# Altium project HMI_STM32_edited.PrjPcb (part 1 of 2)
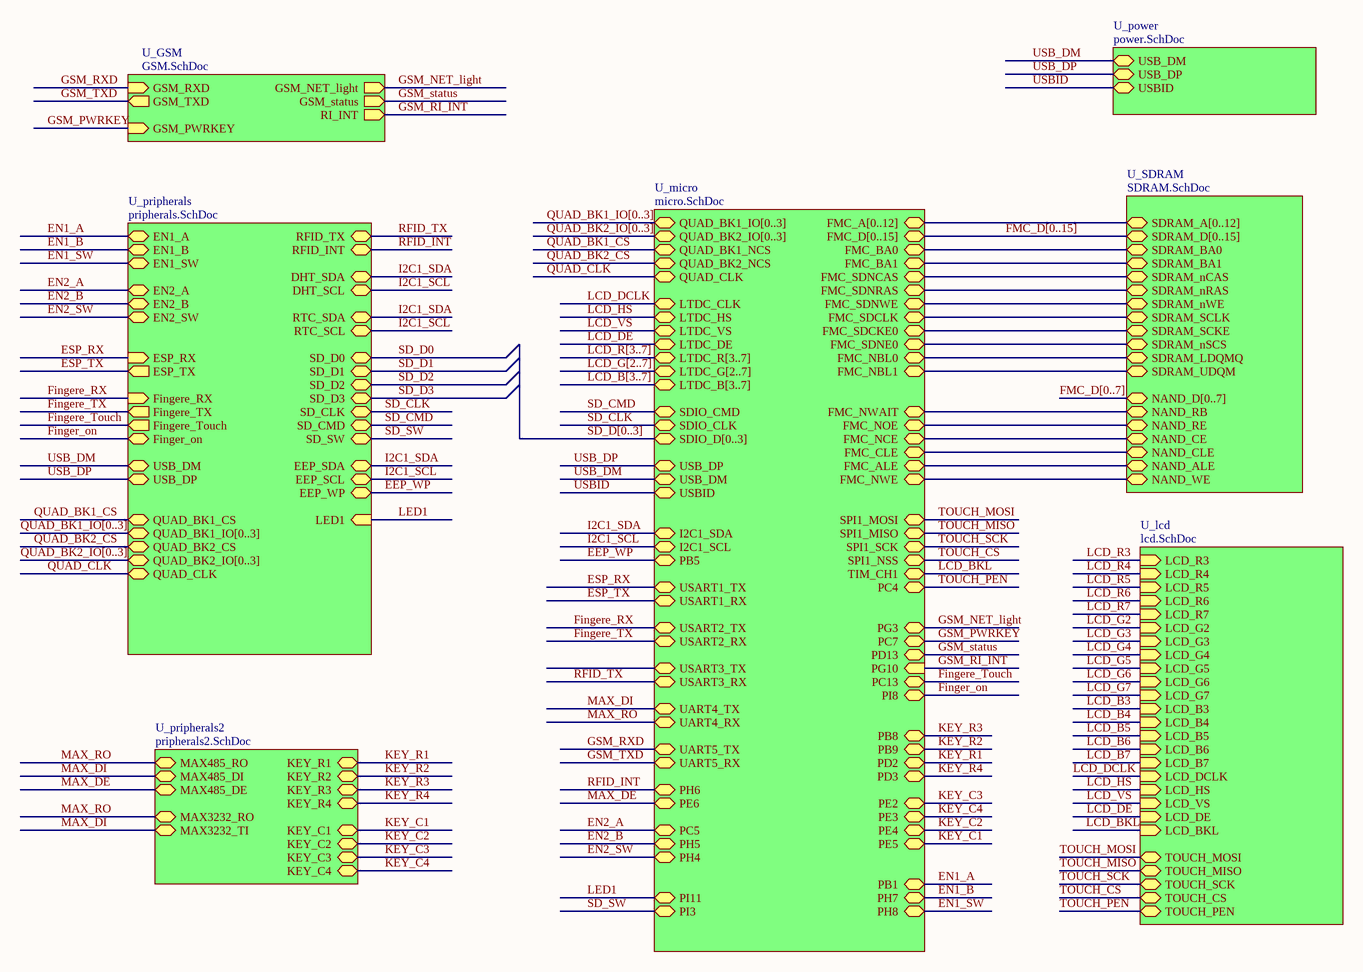
[diagram p0: top.SchDoc]
8 sheets, 237 parts. Net scope: hierarchical (ports join the sheet entries above them; power ports are global).
Board file: HMI_F767_V1.0_edited.PcbDoc
Sheets:
  top.SchDoc
    U_micro = micro.SchDoc
    U_SDRAM = SDRAM.SchDoc
    U_GSM = GSM.SchDoc
    U_lcd = lcd.SchDoc
    U_power = power.SchDoc
    U_pripherals = pripherals.SchDoc
    U_pripherals2 = pripherals2.SchDoc

## Sheet top.SchDoc
size A3

### Sub-sheets
U_GSM = GSM.SchDoc: GSM_PWRKEY (in), GSM_RXD (in), GSM_TXD (out), GSM_NET_light (out), GSM_status (out), RI_INT (out)
U_lcd = lcd.SchDoc: TOUCH_SCK (bidir), TOUCH_CS (bidir), TOUCH_MOSI (bidir), TOUCH_MISO (bidir), TOUCH_PEN (bidir), LCD_B5 (in), LCD_B4 (in), LCD_R7 (in), LCD_B6 (in), LCD_G7 (in), LCD_G6 (in), LCD_G3 (in), LCD_R3 (in), LCD_R5 (in), LCD_R4 (in), LCD_B7 (in), LCD_R6 (in), LCD_G2 (in), LCD_B3 (in), LCD_G5 (in), LCD_G4 (in), LCD_DCLK (in), LCD_DE (in), LCD_HS (in), LCD_VS (in), LCD_BKL (in)
U_micro = micro.SchDoc: FMC_A[0..12] (bidir), FMC_D[0..15] (bidir), QUAD_BK1_IO[0..3] (bidir), QUAD_BK2_IO[0..3] (bidir), LTDC_B[3..7] (bidir), LTDC_R[3..7] (bidir), LTDC_G[2..7] (bidir), SDIO_D[0..3] (bidir), FMC_NCE (bidir), FMC_SDCLK (bidir), FMC_ALE (bidir), FMC_SDNRAS (bidir), FMC_CLE (bidir), FMC_SDNE0 (bidir), FMC_NOE (bidir), FMC_BA1 (bidir), FMC_SDCKE0 (bidir), LTDC_VS (bidir), FMC_NWAIT (bidir), FMC_SDNCAS (bidir), QUAD_BK1_NCS (bidir), LTDC_DE (bidir), LTDC_HS (bidir), LTDC_CLK (bidir), FMC_SDNWE (bidir), QUAD_BK2_NCS (bidir), QUAD_CLK (bidir), FMC_NWE (bidir), SDIO_CLK (bidir), FMC_BA0 (bidir), SDIO_CMD (bidir), FMC_NBL0 (bidir), FMC_NBL1 (bidir), USB_DM (bidir), USB_DP (bidir), SPI1_MOSI (bidir), SPI1_MISO (bidir), TIM_CH1 (bidir), SPI1_SCK (bidir), SPI1_NSS (bidir), PC4 (bidir), I2C1_SDA (bidir), I2C1_SCL (bidir), PB5 (bidir), USART3_TX (bidir), UART5_RX (bidir), UART4_TX (bidir), USART2_TX (bidir), USART1_RX (bidir), USART2_RX (bidir), UART4_RX (bidir), UART5_TX (bidir), USART1_TX (bidir), USART3_RX (bidir), PH6 (bidir), PG3 (bidir), PC7 (bidir), PD13 (bidir), PC13 (bidir), PI8 (bidir), PB8 (bidir), PB9 (bidir), PE3 (bidir), PD2 (bidir), PD3 (bidir), PE2 (bidir), PE4 (bidir), PE5 (bidir), PB1 (bidir), PH8 (bidir), PH7 (bidir), PH4 (bidir), PC5 (bidir), PH5 (bidir), PE6 (bidir), PI3 (bidir), PI11 (bidir), PG10 (in), USBID (bidir)
U_power = power.SchDoc: USB_DM (bidir), USB_DP (bidir), USBID (bidir)
U_pripherals = pripherals.SchDoc: RFID_TX (bidir), RFID_INT (bidir), DHT_SDA (bidir), DHT_SCL (bidir), RTC_SDA (bidir), RTC_SCL (bidir), SD_D0 (bidir), SD_D1 (bidir), SD_D2 (bidir), SD_D3 (bidir), SD_CMD (bidir), SD_CLK (bidir), SD_SW (bidir), EN1_A (bidir), EN1_B (bidir), EN1_SW (bidir), EN2_A (bidir), EN2_B (bidir), EN2_SW (bidir), ESP_TX (out), ESP_RX (in), Fingere_RX (in), Fingere_TX (out), Fingere_Touch (out), EEP_SCL (bidir), EEP_WP (bidir), EEP_SDA (bidir), Finger_on (bidir), LED1 (in), USB_DM (bidir), USB_DP (bidir), QUAD_BK1_CS (bidir), QUAD_BK2_IO[0..3] (bidir), QUAD_BK1_IO[0..3] (bidir), QUAD_BK2_CS (bidir), QUAD_CLK (bidir)
U_pripherals2 = pripherals2.SchDoc: MAX485_RO (bidir), MAX485_DE (bidir), MAX485_DI (bidir), KEY_R1 (bidir), KEY_R2 (bidir), KEY_R3 (bidir), KEY_R4 (bidir), KEY_C1 (bidir), KEY_C2 (bidir), KEY_C3 (bidir), KEY_C4 (bidir), MAX3232_RO (bidir), MAX3232_TI (bidir)
U_SDRAM = SDRAM.SchDoc: SDRAM_D[0..15] (bidir), SDRAM_A[0..12] (bidir), NAND_ALE (bidir), SDRAM_BA0 (bidir), SDRAM_nSCS (bidir), SDRAM_nRAS (bidir), NAND_RE (bidir), SDRAM_nWE (bidir), SDRAM_SCKE (bidir), SDRAM_nCAS (bidir), NAND_CE (bidir), SDRAM_LDQMQ (bidir), NAND_D[0..7] (bidir), NAND_CLE (bidir), NAND_WE (bidir), SDRAM_UDQM (bidir), NAND_RB (bidir), SDRAM_SCLK (bidir), SDRAM_BA1 (bidir)

### Nets
EEP_WP: sheet U_micro/PB5, sheet U_pripherals/EEP_WP
EN1_A: sheet U_micro/PB1, sheet U_pripherals/EN1_A
EN1_B: sheet U_micro/PH7, sheet U_pripherals/EN1_B
EN1_SW: sheet U_micro/PH8, sheet U_pripherals/EN1_SW
EN2_A: sheet U_micro/PC5, sheet U_pripherals/EN2_A
EN2_B: sheet U_micro/PH5, sheet U_pripherals/EN2_B
EN2_SW: sheet U_micro/PH4, sheet U_pripherals/EN2_SW
ESP_RX: sheet U_micro/USART1_TX, sheet U_pripherals/ESP_RX
ESP_TX: sheet U_micro/USART1_RX, sheet U_pripherals/ESP_TX
Finger_on: sheet U_micro/PI8, sheet U_pripherals/Finger_on
Fingere_RX: sheet U_micro/USART2_TX, sheet U_pripherals/Fingere_RX  [project net Finger_RX]
Fingere_Touch: sheet U_micro/PC13, sheet U_pripherals/Fingere_Touch  [project net Finger_Touch]
Fingere_TX: sheet U_micro/USART2_RX, sheet U_pripherals/Fingere_TX  [project net Finger_TX]
FMC_ALE: sheet U_micro/FMC_ALE, sheet U_SDRAM/NAND_ALE
FMC_BA0: sheet U_micro/FMC_BA0, sheet U_SDRAM/SDRAM_BA0
FMC_BA1: sheet U_micro/FMC_BA1, sheet U_SDRAM/SDRAM_BA1
FMC_CLE: sheet U_micro/FMC_CLE, sheet U_SDRAM/NAND_CLE
FMC_NCE: sheet U_micro/FMC_NCE, sheet U_SDRAM/NAND_CE
FMC_NOE: sheet U_micro/FMC_NOE, sheet U_SDRAM/NAND_RE
FMC_NWAIT: sheet U_micro/FMC_NWAIT, sheet U_SDRAM/NAND_RB
FMC_NWE: sheet U_micro/FMC_NWE, sheet U_SDRAM/NAND_WE
FMC_SDCKE0: sheet U_micro/FMC_SDCKE0, sheet U_SDRAM/SDRAM_SCKE
FMC_SDCLK: sheet U_micro/FMC_SDCLK, sheet U_SDRAM/SDRAM_SCLK
FMC_SDNCAS: sheet U_micro/FMC_SDNCAS, sheet U_SDRAM/SDRAM_nCAS
FMC_SDNE0: sheet U_micro/FMC_SDNE0, sheet U_SDRAM/SDRAM_nSCS
FMC_SDNRAS: sheet U_micro/FMC_SDNRAS, sheet U_SDRAM/SDRAM_nRAS
FMC_SDNWE: sheet U_micro/FMC_SDNWE, sheet U_SDRAM/SDRAM_nWE
GSM_NET_light: sheet U_micro/PG3, sheet U_GSM/GSM_NET_light
GSM_PWRKEY: sheet U_micro/PC7, sheet U_GSM/GSM_PWRKEY
GSM_RI_INT: sheet U_micro/PG10, sheet U_GSM/RI_INT
GSM_RXD: sheet U_micro/UART5_TX, sheet U_GSM/GSM_RXD
GSM_status: sheet U_micro/PD13, sheet U_GSM/GSM_status
GSM_TXD: sheet U_micro/UART5_RX, sheet U_GSM/GSM_TXD
I2C1_SCL: sheet U_micro/I2C1_SCL, sheet U_pripherals/DHT_SCL, sheet U_pripherals/RTC_SCL, sheet U_pripherals/EEP_SCL  [project net EEP_SCL]
I2C1_SDA: sheet U_micro/I2C1_SDA, sheet U_pripherals/DHT_SDA, sheet U_pripherals/RTC_SDA, sheet U_pripherals/EEP_SDA  [project net EEP_SDA]
KEY_C1: sheet U_micro/PE5, sheet U_pripherals2/KEY_C1
KEY_C2: sheet U_micro/PE4, sheet U_pripherals2/KEY_C2
KEY_C3: sheet U_micro/PE2, sheet U_pripherals2/KEY_C3
KEY_C4: sheet U_micro/PE3, sheet U_pripherals2/KEY_C4
KEY_R1: sheet U_micro/PD2, sheet U_pripherals2/KEY_R1
KEY_R2: sheet U_micro/PB9, sheet U_pripherals2/KEY_R2
KEY_R3: sheet U_micro/PB8, sheet U_pripherals2/KEY_R3
KEY_R4: sheet U_micro/PD3, sheet U_pripherals2/KEY_R4
LCD_BKL: sheet U_micro/TIM_CH1, sheet U_lcd/LCD_BKL
LCD_DCLK: sheet U_micro/LTDC_CLK, sheet U_lcd/LCD_DCLK
LCD_DE: sheet U_micro/LTDC_DE, sheet U_lcd/LCD_DE
LCD_HS: sheet U_micro/LTDC_HS, sheet U_lcd/LCD_HS
LCD_VS: sheet U_micro/LTDC_VS, sheet U_lcd/LCD_VS
LED1: sheet U_micro/PI11, sheet U_pripherals/LED1
MAX_DE: sheet U_micro/PE6, sheet U_pripherals2/MAX485_DE
MAX_DI: sheet U_micro/UART4_TX, sheet U_pripherals2/MAX485_DI, sheet U_pripherals2/MAX3232_TI
MAX_RO: sheet U_micro/UART4_RX, sheet U_pripherals2/MAX485_RO, sheet U_pripherals2/MAX3232_RO
QUAD_BK1_CS: sheet U_micro/QUAD_BK1_NCS, sheet U_pripherals/QUAD_BK1_CS
QUAD_BK2_CS: sheet U_micro/QUAD_BK2_NCS, sheet U_pripherals/QUAD_BK2_CS
QUAD_CLK: sheet U_micro/QUAD_CLK, sheet U_pripherals/QUAD_CLK
RFID_INT: sheet U_micro/PH6, sheet U_pripherals/RFID_INT
RFID_TX: sheet U_micro/USART3_RX, sheet U_pripherals/RFID_TX
SD_CLK: sheet U_micro/SDIO_CLK, sheet U_pripherals/SD_CLK
SD_CMD: sheet U_micro/SDIO_CMD, sheet U_pripherals/SD_CMD
SD_SW: sheet U_micro/PI3, sheet U_pripherals/SD_SW
TOUCH_CS: sheet U_micro/SPI1_NSS, sheet U_lcd/TOUCH_CS
TOUCH_MISO: sheet U_micro/SPI1_MISO, sheet U_lcd/TOUCH_MISO
TOUCH_MOSI: sheet U_micro/SPI1_MOSI, sheet U_lcd/TOUCH_MOSI
TOUCH_PEN: sheet U_micro/PC4, sheet U_lcd/TOUCH_PEN
TOUCH_SCK: sheet U_micro/SPI1_SCK, sheet U_lcd/TOUCH_SCK
USB_DM: sheet U_micro/USB_DM, sheet U_power/USB_DM, sheet U_pripherals/USB_DM
USB_DP: sheet U_micro/USB_DP, sheet U_power/USB_DP, sheet U_pripherals/USB_DP
USBID: sheet U_micro/USBID, sheet U_power/USBID
NetU4_15: sheet U_micro/FMC_NBL0, sheet U_SDRAM/SDRAM_LDQMQ
NetU4_39: sheet U_micro/FMC_NBL1, sheet U_SDRAM/SDRAM_UDQM

### Buses and harness runs
bus FMC_D[0..7] = sheet U_SDRAM/NAND_D[0..7]
bus FMC_D[0..15] = sheet U_micro/FMC_D[0..15] = sheet U_SDRAM/SDRAM_D[0..15]
bus LCD_B[3..7] = sheet U_micro/LTDC_B[3..7]
bus LCD_G[2..7] = sheet U_micro/LTDC_G[2..7]
bus LCD_R[3..7] = sheet U_micro/LTDC_R[3..7]
bus QUAD_BK1_IO[0..3] = sheet U_micro/QUAD_BK1_IO[0..3]
bus QUAD_BK1_IO[0..3] = sheet U_pripherals/QUAD_BK1_IO[0..3]
bus QUAD_BK2_IO[0..3] = sheet U_micro/QUAD_BK2_IO[0..3]
bus QUAD_BK2_IO[0..3] = sheet U_pripherals/QUAD_BK2_IO[0..3]
bus SD_D[0..3] = sheet U_micro/SDIO_D[0..3]
bus sheet U_micro/FMC_A[0..12] = sheet U_SDRAM/SDRAM_A[0..12]

## Sheet micro.SchDoc: Micro controller
size A3; Author: Babaabasi; Engineer: Babaabasi; DocumentNumber: 1; Revision: 0.1
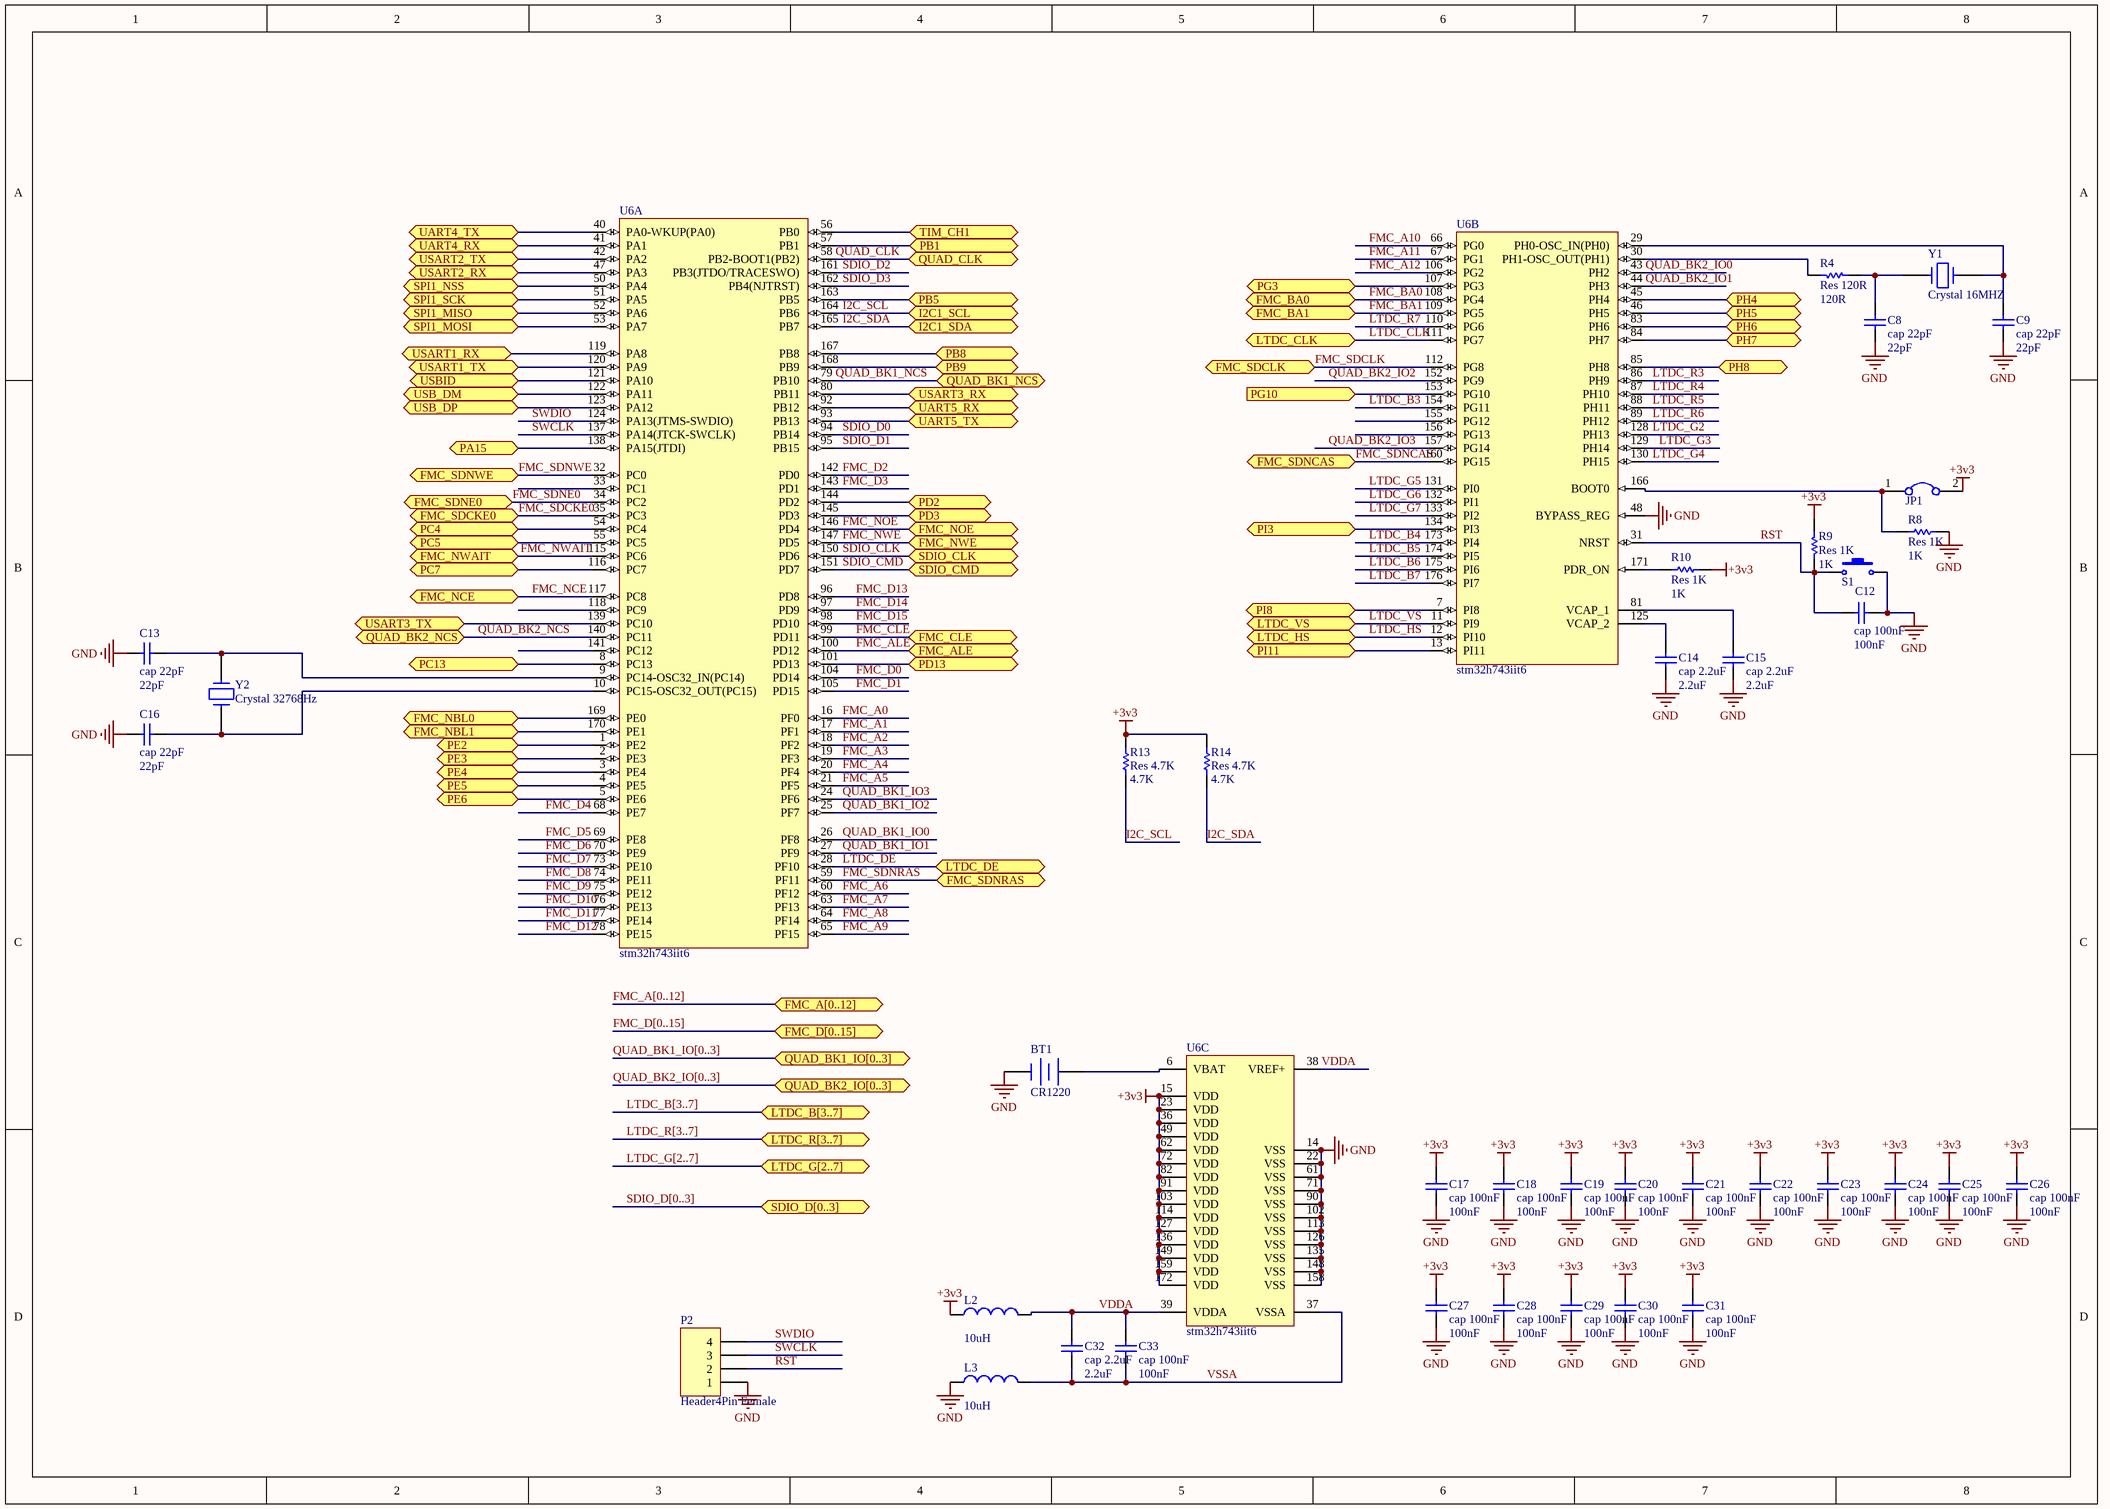
[diagram p1: micro.SchDoc]

### Parts
BT1  CR1220  [BTH1220]
C8  cap 22pF  value 22pF  [Cap 805]
C9  cap 22pF  value 22pF  [Cap 805]
C12  cap 100nF  value 100nF  [Cap 805]
C13  cap 22pF  value 22pF  [Cap 805]
C14  cap 2.2uF  value 2.2uF  [Cap 805]
C15  cap 2.2uF  value 2.2uF  [Cap 805]
C16  cap 22pF  value 22pF  [Cap 805]
C17  cap 100nF  value 100nF  [Cap 805]
C18  cap 100nF  value 100nF  [Cap 805]
C19  cap 100nF  value 100nF  [Cap 805]
C20  cap 100nF  value 100nF  [Cap 805]
C21  cap 100nF  value 100nF  [Cap 805]
C22  cap 100nF  value 100nF  [Cap 805]
C23  cap 100nF  value 100nF  [Cap 805]
C24  cap 100nF  value 100nF  [Cap 805]
C25  cap 100nF  value 100nF  [Cap 805]
C26  cap 100nF  value 100nF  [Cap 805]
C27  cap 100nF  value 100nF  [Cap 805]
C28  cap 100nF  value 100nF  [Cap 805]
C29  cap 100nF  value 100nF  [Cap 805]
C30  cap 100nF  value 100nF  [Cap 805]
C31  cap 100nF  value 100nF  [Cap 805]
C32  cap 2.2uF  value 2.2uF  [Cap 805]
C33  cap 100nF  value 100nF  [Cap 805]
JP1  Jumper  [Jumper Small - 2.54 - GRAY]  (value not drawn)  (no BOM)
L2  value 10uH  [IND1206]  (hidden comment: inductor 10uH)
L3  value 10uH  [IND1206]  (hidden comment: inductor 10uH)
P2  Header4Pin Female  [HDR1X4]
R4  Res 120R  value 120R  [RES 0805 (2012X06L)]
R8  Res 1K  value 1K  [RES 0805 (2012X06L)]
R9  Res 1K  value 1K  [RES 0805 (2012X06L)]
R10  Res 1K  value 1K  [RES 0805 (2012X06L)]
R13  Res 4.7K  value 4.7K  [RES 0805 (2012X06L)]
R14  Res 4.7K  value 4.7K  [RES 0805 (2012X06L)]
S1  Switch PB  [Switch - Push to On]  (value not drawn)
U6  stm32h743iit6  [STM-LQFP176_M]  (parts A,B,C of 3)
Y1  Crystal 16MHZ  [CRYSTAL Small]
Y2  Crystal 32768Hz  [XTAL RTC]

### Ports
FMC_A[0..12] (bidir), FMC_ALE (bidir), FMC_BA0 (bidir), FMC_BA1 (bidir), FMC_CLE (bidir), FMC_D[0..15] (bidir), FMC_NBL0 (bidir), FMC_NBL1 (bidir), FMC_NCE (bidir), FMC_NOE (bidir), FMC_NWAIT (bidir), FMC_NWE (bidir), FMC_SDCKE0 (bidir), FMC_SDCLK (bidir), FMC_SDNCAS (bidir), FMC_SDNE0 (bidir), FMC_SDNRAS (bidir), FMC_SDNWE (bidir), I2C1_SCL (bidir), I2C1_SDA (bidir), LTDC_B[3..7] (bidir), LTDC_CLK (bidir), LTDC_DE (bidir), LTDC_G[2..7] (bidir), LTDC_HS (bidir), LTDC_R[3..7] (bidir), LTDC_VS (bidir), PA15 (bidir), PB1 (bidir), PB5 (bidir), PB8 (bidir), PB9 (bidir), PC4 (bidir), PC5 (bidir), PC7 (bidir), PC13 (bidir), PD2 (bidir), PD3 (bidir), PD13 (bidir), PE2 (bidir), PE3 (bidir), PE4 (bidir), PE5 (bidir), PE6 (bidir), PG3 (bidir), PG10 (in), PH4 (bidir), PH5 (bidir), PH6 (bidir), PH7 (bidir), PH8 (bidir), PI3 (bidir), PI8 (bidir), PI11 (bidir), QUAD_BK1_IO[0..3] (bidir), QUAD_BK1_NCS (bidir), QUAD_BK2_IO[0..3] (bidir), QUAD_BK2_NCS (bidir), QUAD_CLK (bidir), SDIO_CLK (bidir), SDIO_CMD (bidir), SDIO_D[0..3] (bidir), SPI1_MISO (bidir), SPI1_MOSI (bidir), SPI1_NSS (bidir), SPI1_SCK (bidir), TIM_CH1 (bidir), UART4_RX (bidir), UART4_TX (bidir), UART5_RX (bidir), UART5_TX (bidir), USART1_RX (bidir), USART1_TX (bidir), USART2_RX (bidir), USART2_TX (bidir), USART3_RX (bidir), USART3_TX (bidir), USB_DM (bidir), USB_DP (bidir), USBID (bidir)

### Nets
+3v3: C17.2 C18.2 C19.2 C20.2 C21.2 C22.2 C23.2 C24.2 C25.2 C26.2 C27.2 C28.2 C29.2 C30.2 C31.2 JP1.2 L2.1 R9.1 R10.2 R13.1 R14.1 U6.15(VDD) U6.23(VDD) U6.36(VDD) U6.49(VDD) U6.62(VDD) U6.72(VDD) U6.82(VDD) U6.91(VDD) U6.103(VDD) U6.114(VDD) U6.127(VDD) U6.136(VDD) U6.149(VDD) U6.159(VDD) U6.172(VDD)
GND: BT1.2(-) C8.1 C9.2 C12.2 C13.1 C14.1 C15.1 C16.1 C17.1 C18.1 C19.1 C20.1 C21.1 C22.1 C23.1 C24.1 C25.1 C26.1 C27.1 C28.1 C29.1 C30.1 C31.1 L3.1 P2.1 R8.2 S1.1 U6.14(VSS) U6.22(VSS) U6.48(BYPASS_REG) U6.61(VSS) U6.71(VSS) U6.90(VSS) U6.102(VSS) U6.113(VSS) U6.126(VSS) U6.135(VSS) U6.148(VSS) U6.158(VSS)
EEP_WP: U6.163(PB5) ; port PB5
EN1_A: U6.57(PB1) ; port PB1
EN1_B: U6.84(PH7) ; port PH7
EN1_SW: U6.85(PH8) ; port PH8
EN2_A: U6.55(PC5) ; port PC5
EN2_B: U6.46(PH5) ; port PH5
EN2_SW: U6.45(PH4) ; port PH4
ESP_RX: U6.120(PA9) ; port USART1_TX
ESP_TX: U6.119(PA8) ; port USART1_RX
Finger_on: U6.7(PI8) ; port PI8
Finger_RX: U6.42(PA2) ; port USART2_TX
Finger_Touch: U6.8(PC13) ; port PC13
Finger_TX: U6.47(PA3) ; port USART2_RX
FMC_A0: U6.16(PF0)
FMC_A1: U6.17(PF1)
FMC_A2: U6.18(PF2)
FMC_A3: U6.19(PF3)
FMC_A4: U6.20(PF4)
FMC_A5: U6.21(PF5)
FMC_A6: U6.60(PF12)
FMC_A7: U6.63(PF13)
FMC_A8: U6.64(PF14)
FMC_A9: U6.65(PF15)
FMC_A10: U6.66(PG0)
FMC_A11: U6.67(PG1)
FMC_A12: U6.106(PG2)
FMC_ALE: U6.100(PD12) ; port FMC_ALE
FMC_BA0: U6.108(PG4) ; port FMC_BA0
FMC_BA1: U6.109(PG5) ; port FMC_BA1
FMC_CLE: U6.99(PD11) ; port FMC_CLE
FMC_D0: U6.104(PD14)
FMC_D1: U6.105(PD15)
FMC_D2: U6.142(PD0)
FMC_D3: U6.143(PD1)
FMC_D4: U6.68(PE7)
FMC_D5: U6.69(PE8)
FMC_D6: U6.70(PE9)
FMC_D7: U6.73(PE10)
FMC_D8: U6.74(PE11)
FMC_D9: U6.75(PE12)
FMC_D10: U6.76(PE13)
FMC_D11: U6.77(PE14)
FMC_D12: U6.78(PE15)
FMC_D13: U6.96(PD8)
FMC_D14: U6.97(PD9)
FMC_D15: U6.98(PD10)
FMC_NCE: U6.117(PC8) ; port FMC_NCE
FMC_NOE: U6.146(PD4) ; port FMC_NOE
FMC_NWAIT: U6.115(PC6) ; port FMC_NWAIT
FMC_NWE: U6.147(PD5) ; port FMC_NWE
FMC_SDCKE0: U6.35(PC3) ; port FMC_SDCKE0
FMC_SDCLK: U6.112(PG8) ; port FMC_SDCLK
FMC_SDNCAS: U6.160(PG15) ; port FMC_SDNCAS
FMC_SDNE0: U6.34(PC2) ; port FMC_SDNE0
FMC_SDNRAS: U6.59(PF11) ; port FMC_SDNRAS
FMC_SDNWE: U6.32(PC0) ; port FMC_SDNWE
GSM_NET_light: U6.107(PG3) ; port PG3
GSM_PWRKEY: U6.116(PC7) ; port PC7
GSM_RI_INT: U6.153(PG10) ; port PG10
GSM_RXD: U6.93(PB13) ; port UART5_TX
GSM_status: U6.101(PD13) ; port PD13
GSM_TXD: U6.92(PB12) ; port UART5_RX
I2C_SCL: R13.2 U6.164(PB6) ; port I2C1_SCL  [project net EEP_SCL]
I2C_SDA: R14.2 U6.165(PB7) ; port I2C1_SDA  [project net EEP_SDA]
KEY_C1: U6.4(PE5) ; port PE5
KEY_C2: U6.3(PE4) ; port PE4
KEY_C3: U6.1(PE2) ; port PE2
KEY_C4: U6.2(PE3) ; port PE3
KEY_R1: U6.144(PD2) ; port PD2
KEY_R2: U6.168(PB9) ; port PB9
KEY_R3: U6.167(PB8) ; port PB8
KEY_R4: U6.145(PD3) ; port PD3
LCD_BKL: U6.56(PB0) ; port TIM_CH1
LED1: U6.13(PI11) ; port PI11
LTDC_B3: U6.154(PG11)  [project net LCD_B3]
LTDC_B4: U6.173(PI4)  [project net LCD_B4]
LTDC_B5: U6.174(PI5)  [project net LCD_B5]
LTDC_B6: U6.175(PI6)  [project net LCD_B6]
LTDC_B7: U6.176(PI7)  [project net LCD_B7]
LTDC_CLK: U6.111(PG7) ; port LTDC_CLK  [project net LCD_DCLK]
LTDC_DE: U6.28(PF10) ; port LTDC_DE  [project net LCD_DE]
LTDC_G2: U6.128(PH13)  [project net LCD_G2]
LTDC_G3: U6.129(PH14)  [project net LCD_G3]
LTDC_G4: U6.130(PH15)  [project net LCD_G4]
LTDC_G5: U6.131(PI0)  [project net LCD_G5]
LTDC_G6: U6.132(PI1)  [project net LCD_G6]
LTDC_G7: U6.133(PI2)  [project net LCD_G7]
LTDC_HS: U6.12(PI10) ; port LTDC_HS  [project net LCD_HS]
LTDC_R3: U6.86(PH9)  [project net LCD_R3]
LTDC_R4: U6.87(PH10)  [project net LCD_R4]
LTDC_R5: U6.88(PH11)  [project net LCD_R5]
LTDC_R6: U6.89(PH12)  [project net LCD_R6]
LTDC_R7: U6.110(PG6)  [project net LCD_R7]
LTDC_VS: U6.11(PI9) ; port LTDC_VS  [project net LCD_VS]
MAX_DE: U6.5(PE6) ; port PE6
MAX_DI: U6.40(PA0-WKUP(PA0)) ; port UART4_TX
MAX_RO: U6.41(PA1) ; port UART4_RX
QUAD_BK1_IO0: U6.26(PF8)
QUAD_BK1_IO1: U6.27(PF9)
QUAD_BK1_IO2: U6.25(PF7)
QUAD_BK1_IO3: U6.24(PF6)
QUAD_BK1_NCS: U6.79(PB10) ; port QUAD_BK1_NCS  [project net QUAD_BK1_CS]
QUAD_BK2_IO0: U6.43(PH2)
QUAD_BK2_IO1: U6.44(PH3)
QUAD_BK2_IO2: U6.152(PG9)
QUAD_BK2_IO3: U6.157(PG14)
QUAD_BK2_NCS: U6.140(PC11) ; port QUAD_BK2_NCS  [project net QUAD_BK2_CS]
QUAD_CLK: U6.58(PB2-BOOT1(PB2)) ; port QUAD_CLK
RFID_INT: U6.83(PH6) ; port PH6
RFID_TX: U6.80(PB11) ; port USART3_RX
RST: C12.1 P2.2 R9.2 S1.2 U6.31(NRST)
SD_SW: U6.134(PI3) ; port PI3
SDIO_CLK: U6.150(PD6) ; port SDIO_CLK  [project net SD_CLK]
SDIO_CMD: U6.151(PD7) ; port SDIO_CMD  [project net SD_CMD]
SDIO_D0: U6.94(PB14)  [project net SD_D0]
SDIO_D1: U6.95(PB15)  [project net SD_D1]
SDIO_D2: U6.161(PB3(JTDO/TRACESWO))  [project net SD_D2]
SDIO_D3: U6.162(PB4(NJTRST))  [project net SD_D3]
SWCLK: P2.3 U6.137(PA14(JTCK-SWCLK))
SWDIO: P2.4 U6.124(PA13(JTMS-SWDIO))
TOUCH_CS: U6.50(PA4) ; port SPI1_NSS
TOUCH_MISO: U6.52(PA6) ; port SPI1_MISO
TOUCH_MOSI: U6.53(PA7) ; port SPI1_MOSI
TOUCH_PEN: U6.54(PC4) ; port PC4
TOUCH_SCK: U6.51(PA5) ; port SPI1_SCK
USB_DM: U6.122(PA11) ; port USB_DM
USB_DP: U6.123(PA12) ; port USB_DP
USBID: U6.121(PA10) ; port USBID
VDDA: C32.2 C33.2 L2.2 U6.38(VREF+) U6.39(VDDA)
VSSA: C32.1 C33.1 L3.2 U6.37(VSSA)
NetBT1_1: BT1.1(+) U6.6(VBAT)
NetC8_2: C8.2 R4.2 Y1.2
NetC9_1: C9.1 U6.29(PH0-OSC_IN(PH0)) Y1.1
NetC13_2: C13.2 U6.9(PC14-OSC32_IN(PC14)) Y2.1
NetC14_2: C14.2 U6.125(VCAP_2)
NetC15_2: C15.2 U6.81(VCAP_1)
NetC16_2: C16.2 U6.10(PC15-OSC32_OUT(PC15)) Y2.2
NetJP1_1: JP1.1 R8.1 U6.166(BOOT0)
NetR4_1: R4.1 U6.30(PH1-OSC_OUT(PH1))
NetR10_1: R10.1 U6.171(PDR_ON)
NetU4_15: U6.169(PE0) ; port FMC_NBL0
NetU4_39: U6.170(PE1) ; port FMC_NBL1
NetU6_138: U6.138(PA15(JTDI)) ; port PA15
NetU6_139: U6.139(PC10) ; port USART3_TX

Not connected (* = marked no-connect by the designer): U6 33(PC1) 118(PC9) 141(PC12) 155(PG12) 156(PG13)

### Buses and harness runs
bus FMC_A[0..12] = port FMC_A[0..12]
bus FMC_D[0..15] = port FMC_D[0..15]
bus LTDC_B[3..7] = port LTDC_B[3..7]
bus LTDC_G[2..7] = port LTDC_G[2..7]
bus LTDC_R[3..7] = port LTDC_R[3..7]
bus QUAD_BK1_IO[0..3] = port QUAD_BK1_IO[0..3]
bus QUAD_BK2_IO[0..3] = port QUAD_BK2_IO[0..3]
bus SDIO_D[0..3] = port SDIO_D[0..3]

### Notes on the sheet
- Title
- Size:
- Date:
- A3
- Number:
- Time:
- Revision:
- Sheet
- of
- File:

### Library data of the parts
BT1 = Battery: CoinCell Battery; Published: 24-Mar-1999; LatestRevisionDate: 17-Jul-2002; LatestRevisionNote: Re-released for DXP Platform.; PackageReference: BAT-2; Publisher: Altium Limited; PackageDescription: Battery; 2 Leads
C8 C9 C12-C33 = Cap: Capacitor; Published: 8-Jun-2000; LatestRevisionDate: 17-Jul-2002; LatestRevisionNote: Re-released for DXP Platform.; PackageReference: RAD-0.3; Publisher: Altium Limited; PackageDescription: Radial Cap, Thru-Hole; 2 Leads; 0.3 in Pin Spacing
JP1 = Jumper: Boot select; Company: E.P.I.L; Defualt State: Close; Design Date: 2011/11/02
L2 L3 = Inductor: Code_IEC: 1005; Published: 8-Jun-2000; LatestRevisionDate: 29-May-2009; LatestRevisionNote: IPC-7351 Footprint Added.; PackageReference: 0402-A; Publisher: Altium Limited; PackageDescription: Chip Inductor; Code_JEITA: 0402
P2 = Header 4: Header, 4-Pin; LatestRevisionDate: 17-Jul-2002; LatestRevisionNote: Re-released for DXP Platform.; Publisher: Altium Limited
R4 R8-R10 R13 R14 = Res1: Resistor; Published: 8-Jun-2000; LatestRevisionDate: 17-Jul-2002; LatestRevisionNote: Re-released for DXP Platform.; PackageReference: AXIAL-0.3; Publisher: Altium Limited; PackageDescription: Axial Device, Thru-Hole; 2 Leads; 0.3 in Pin Spacing
S1 = Switch PB: Push Button Switch
U6 = STM32F429IGT6: ARM Cortex-M4 32-bit MCU+FPU, 225 DMIPS, 1024 kB Flash, 256 kB Internal RAM, 140 I/Os, 176-pin LQFP, -40 to 85 degC, Tray; Manufacturer: STMicroelectronics; D/A Converter: 2x12-bit; FLASH Size (Prog) (kB): 1024; I/Os (High Current): 140; Internal RAM Size (kB): 256; Operating Frequency(F) (Processor speed) (MHz): 180; Supply Voltage(Vcc) max (V): 3.6; Supply Voltage(Vcc) min (V): 1.8; DatasheetVersion: Rev. 2; PackageVersion: Rev. 4, 06/2013; PackageReference: LQFP176; PackageDescription: 176-Pin Low Profile Quad Flat Package, 24 x 24 mm Body, 0.5 mm Pitch; Supplier 1: Digi-Key; Supplier Part Number 1: STM32F429IGT6-ND; Supplier 2: Newark; Supplier Part Number 2: 06X3669; Supplier 3: Mouser; Supplier Part Number 3: 511-STM32F429IGT6; Core: ARM Cortex-M4; Packing: Tray; Mounting Technology: Surface Mount; PartNumber: STM32F429IGT6; ComponentLink1Description: Manufacturer URL; ComponentLink1URL: http://www.st.com/web/en/home.html; ComponentLink2Description: Datasheet; ComponentLink2URL: http://www.st.com/st-web-ui/static/active/en/resource/technical/document/data_brief/DM00053488.pdf; ComponentLink3Description: Package Specification; ComponentLink3URL: http://www.st.com/st-web-ui/static/active/en/resource/technical/document/datasheet/DM00035129.pdf
Y1 Y2 = CRYSTAL

## Sheet SDRAM.SchDoc
size A4
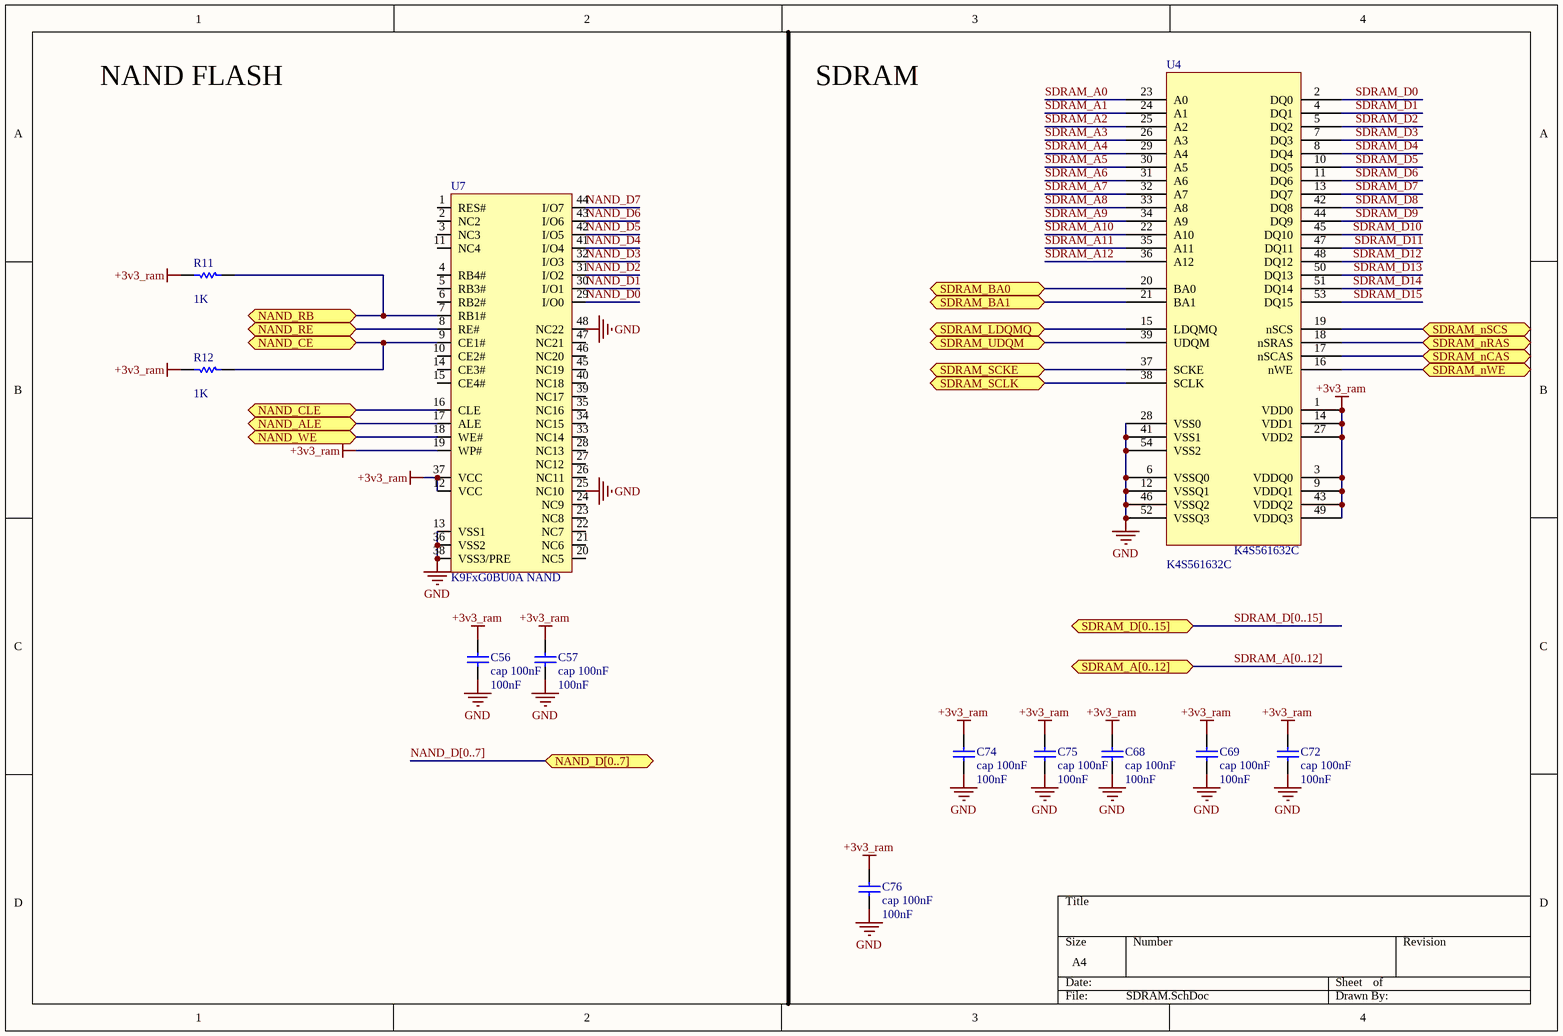
[diagram p2: SDRAM.SchDoc]

### Parts
C56  cap 100nF  value 100nF  [Cap 805]
C57  cap 100nF  value 100nF  [Cap 805]
C68  cap 100nF  value 100nF  [Cap 805]
C69  cap 100nF  value 100nF  [Cap 805]
C72  cap 100nF  value 100nF  [Cap 805]
C74  cap 100nF  value 100nF  [Cap 805]
C75  cap 100nF  value 100nF  [Cap 805]
C76  cap 100nF  value 100nF  [Cap 805]
R11  value 1K  [RES 0805 (2012X06L)]  (hidden comment: Res 1K)
R12  value 1K  [RES 0805 (2012X06L)]  (hidden comment: Res 1K)
U4  K4S561632C  [RAM]
U7  K9FxG0BU0A NAND  [TSOP-48]

### Ports
NAND_ALE (bidir), NAND_CE (bidir), NAND_CLE (bidir), NAND_D[0..7] (bidir), NAND_RB (bidir), NAND_RE (bidir), NAND_WE (bidir), SDRAM_A[0..12] (bidir), SDRAM_BA0 (bidir), SDRAM_BA1 (bidir), SDRAM_D[0..15] (bidir), SDRAM_LDQMQ (bidir), SDRAM_nCAS (bidir), SDRAM_nRAS (bidir), SDRAM_nSCS (bidir), SDRAM_nWE (bidir), SDRAM_SCKE (bidir), SDRAM_SCLK (bidir), SDRAM_UDQM (bidir)

### Nets
+3v3_ram: C56.2 C57.2 C68.2 C69.2 C72.2 C74.2 C75.2 C76.2 R11.2 R12.1 U4.1(VDD0) U4.3(VDDQ0) U4.9(VDDQ1) U4.14(VDD1) U4.27(VDD2) U4.43(VDDQ2) U4.49(VDDQ3) U7.12(VCC) U7.19(WP#) U7.37(VCC)
GND: C56.1 C57.1 C68.1 C69.1 C72.1 C74.1 C75.1 C76.1 U4.6(VSSQ0) U4.12(VSSQ1) U4.28(VSS0) U4.41(VSS1) U4.46(VSSQ2) U4.52(VSSQ3) U4.54(VSS2) U7.13(VSS1) U7.25(NC10) U7.36(VSS2) U7.38(VSS3/PRE) U7.48(NC22)
FMC_ALE: U7.17(ALE) ; port NAND_ALE
FMC_BA0: U4.20(BA0) ; port SDRAM_BA0
FMC_BA1: U4.21(BA1) ; port SDRAM_BA1
FMC_CLE: U7.16(CLE) ; port NAND_CLE
FMC_NCE: R12.2 U7.9(CE1#) ; port NAND_CE
FMC_NOE: U7.8(RE#) ; port NAND_RE
FMC_NWAIT: R11.1 U7.7(RB1#) ; port NAND_RB
FMC_NWE: U7.18(WE#) ; port NAND_WE
FMC_SDCKE0: U4.37(SCKE) ; port SDRAM_SCKE
FMC_SDCLK: U4.38(SCLK) ; port SDRAM_SCLK
FMC_SDNCAS: U4.17(nSCAS) ; port SDRAM_nCAS
FMC_SDNE0: U4.19(nSCS) ; port SDRAM_nSCS
FMC_SDNRAS: U4.18(nSRAS) ; port SDRAM_nRAS
FMC_SDNWE: U4.16(nWE) ; port SDRAM_nWE
NAND_D0: U4.2(DQ0) U7.29(I/O0)  [also labelled SDRAM_D0]  [project net FMC_D0]
NAND_D1: U4.4(DQ1) U7.30(I/O1)  [also labelled SDRAM_D1]  [project net FMC_D1]
NAND_D2: U4.5(DQ2) U7.31(I/O2)  [also labelled SDRAM_D2]  [project net FMC_D2]
NAND_D3: U4.7(DQ3) U7.32(I/O3)  [also labelled SDRAM_D3]  [project net FMC_D3]
NAND_D4: U4.8(DQ4) U7.41(I/O4)  [also labelled SDRAM_D4]  [project net FMC_D4]
NAND_D5: U4.10(DQ5) U7.42(I/O5)  [also labelled SDRAM_D5]  [project net FMC_D5]
NAND_D6: U4.11(DQ6) U7.43(I/O6)  [also labelled SDRAM_D6]  [project net FMC_D6]
NAND_D7: U4.13(DQ7) U7.44(I/O7)  [also labelled SDRAM_D7]  [project net FMC_D7]
SDRAM_A0: U4.23(A0)  [project net FMC_A0]
SDRAM_A1: U4.24(A1)  [project net FMC_A1]
SDRAM_A2: U4.25(A2)  [project net FMC_A2]
SDRAM_A3: U4.26(A3)  [project net FMC_A3]
SDRAM_A4: U4.29(A4)  [project net FMC_A4]
SDRAM_A5: U4.30(A5)  [project net FMC_A5]
SDRAM_A6: U4.31(A6)  [project net FMC_A6]
SDRAM_A7: U4.32(A7)  [project net FMC_A7]
SDRAM_A8: U4.33(A8)  [project net FMC_A8]
SDRAM_A9: U4.34(A9)  [project net FMC_A9]
SDRAM_A10: U4.22(A10)  [project net FMC_A10]
SDRAM_A11: U4.35(A11)  [project net FMC_A11]
SDRAM_A12: U4.36(A12)  [project net FMC_A12]
SDRAM_D8: U4.42(DQ8)  [project net FMC_D8]
SDRAM_D9: U4.44(DQ9)  [project net FMC_D9]
SDRAM_D10: U4.45(DQ10)  [project net FMC_D10]
SDRAM_D11: U4.47(DQ11)  [project net FMC_D11]
SDRAM_D12: U4.48(DQ12)  [project net FMC_D12]
SDRAM_D13: U4.50(DQ13)  [project net FMC_D13]
SDRAM_D14: U4.51(DQ14)  [project net FMC_D14]
SDRAM_D15: U4.53(DQ15)  [project net FMC_D15]
NetU4_15: U4.15(LDQMQ) ; port SDRAM_LDQMQ
NetU4_39: U4.39(UDQM) ; port SDRAM_UDQM

Not connected (* = marked no-connect by the designer): U7 1(RES#) 2(NC2) 3(NC3) 4(RB4#) 5(RB3#) 6(RB2#) 10(CE2#) 11(NC4) 14(CE3#) 15(CE4#) 20(NC5) 21(NC6) 22(NC7) 23(NC8) 24(NC9) 26(NC11) 27(NC12) 28(NC13) 33(NC14) 34(NC15) 35(NC16) 39(NC17) 40(NC18) 45(NC19) 46(NC20) 47(NC21)

### Buses and harness runs
bus NAND_D[0..7] = port NAND_D[0..7]
bus SDRAM_A[0..12] = port SDRAM_A[0..12]
bus SDRAM_D[0..15] = port SDRAM_D[0..15]

### Notes on the sheet
- NAND FLASH
- SDRAM

### Library data of the parts
C56 C57 C68 C69 C72 C74-C76 = Cap: Capacitor; Published: 8-Jun-2000; LatestRevisionDate: 17-Jul-2002; LatestRevisionNote: Re-released for DXP Platform.; PackageReference: RAD-0.3; Publisher: Altium Limited; PackageDescription: Radial Cap, Thru-Hole; 2 Leads; 0.3 in Pin Spacing
R11 R12 = Res1: Resistor; Published: 8-Jun-2000; LatestRevisionDate: 17-Jul-2002; LatestRevisionNote: Re-released for DXP Platform.; PackageReference: AXIAL-0.3; Publisher: Altium Limited; PackageDescription: Axial Device, Thru-Hole; 2 Leads; 0.3 in Pin Spacing
U4 = K4S561632C: MT48LC16M16A2P or K4S561632C SDram
U7 = K9FxG0BU0A NAND: Nand Flash

## Sheet GSM.SchDoc
size A4
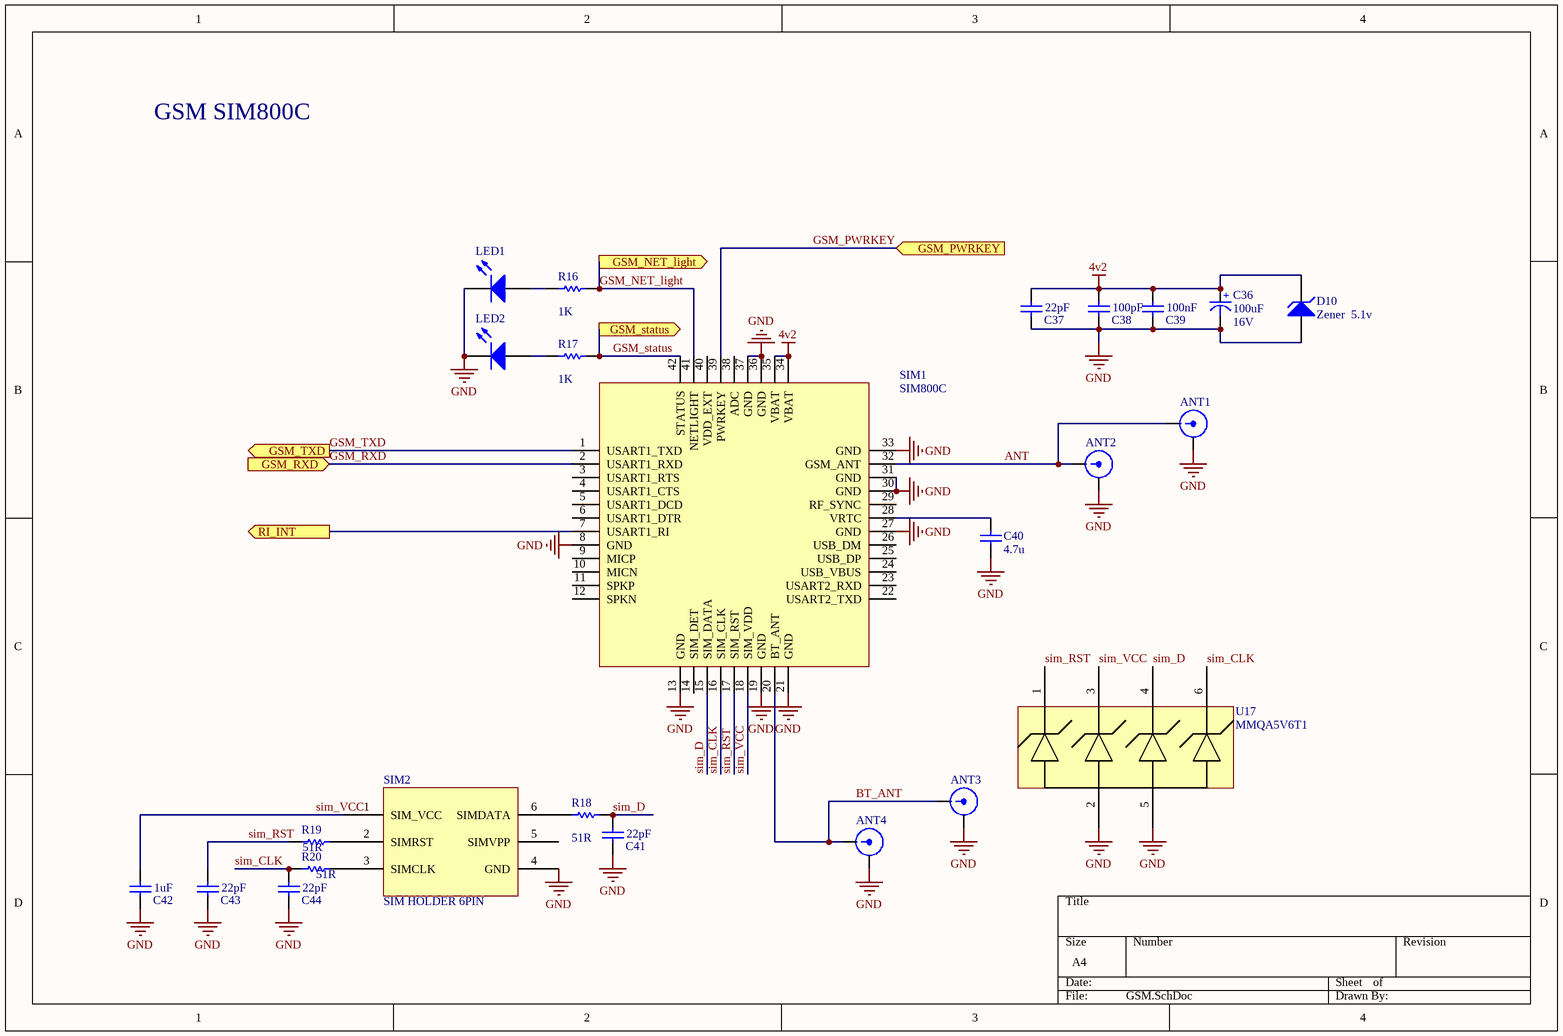
[diagram p3: GSM.SchDoc]

### Parts
ANT1  Antenna UFL  [UFL ant]  (value not drawn)
ANT2  Antenna SMA  [SMA]  (value not drawn)
ANT3  Antenna UFL  [UFL ant]  (value not drawn)
ANT4  Antenna SMA  [SMA]  (value not drawn)
C36  value 100uF  Voltage: 16V  [Cap 1206 (3216X18L) Size A]  (hidden comment: cap 100uF)
C37  value 22pF  [Cap 805]  (hidden comment: cap 22pF)
C38  value 100pF  [Cap 805]  (hidden comment: cap 100pF)
C39  value 100nF  [Cap 805]  (hidden comment: cap 100nF)
C40  value 4.7u  [Cap 805]  (hidden comment: cap 4.7u)
C41  value 22pF  [Cap 805]  (hidden comment: cap 22pF)
C42  value 1uF  [Cap 805]  (hidden comment: cap 1uF)
C43  value 22pF  [Cap 805]  (hidden comment: cap 22pF)
C44  value 22pF  [Cap 805]  (hidden comment: cap 22pF)
D10  Zener  5.1v  [Diode 1n4148 SMD]
LED1  LED Green  [0805-LED]  (value not drawn)
LED2  LED Red  [0805-LED]  (value not drawn)
R16  value 1K  [RES 0805 (2012X06L)]  (hidden comment: Res 1K)
R17  value 1K  [RES 0805 (2012X06L)]  (hidden comment: Res 1K)
R18  value 51R  [RES 0805 (2012X06L)]  (hidden comment: Res 51R)
R19  value 51R  [RES 0805 (2012X06L)]  (hidden comment: Res 51R)
R20  value 51R  [RES 0805 (2012X06L)]  (hidden comment: Res 51R)
SIM1  SIM800C  [SIM800C]
SIM2  SIM HOLDER 6PIN  [simcard_holder]
U17  MMQA5V6T1  [SOT23-6]

### Ports
GSM_NET_light (out), GSM_PWRKEY (in), GSM_RXD (in), GSM_status (out), GSM_TXD (out), RI_INT (out)

### Nets
4v2: C36.1(+) C37.2 C38.2 C39.2 D10.2(K) SIM1.34(VBAT) SIM1.35(VBAT)
GND: ANT1.2 ANT2.2 ANT3.2 ANT4.2 C36.2(-) C37.1 C38.1 C39.1 C40.1 C41.1 C42.1 C43.1 C44.1 D10.1(A) LED1.K LED2.K SIM1.8(GND) SIM1.13(GND) SIM1.19(GND) SIM1.21(GND) SIM1.27(GND) SIM1.30(GND) SIM1.31(GND) SIM1.33(GND) SIM1.36(GND) SIM1.37(GND) SIM2.4(GND) U17.2(Cathode) U17.5(Cathode)
ANT: ANT1.1 ANT2.1 SIM1.32(GSM_ANT)
BT_ANT: ANT3.1 ANT4.1 SIM1.20(BT_ANT)
GSM_NET_light: R16.1 SIM1.41(NETLIGHT) ; port GSM_NET_light
GSM_PWRKEY: SIM1.39(PWRKEY) ; port GSM_PWRKEY
GSM_RI_INT: SIM1.7(USART1_RI) ; port RI_INT
GSM_RXD: SIM1.2(USART1_RXD) ; port GSM_RXD
GSM_status: R17.1 SIM1.42(STATUS) ; port GSM_status
GSM_TXD: SIM1.1(USART1_TXD) ; port GSM_TXD
sim_CLK: C44.2 R20.1 SIM1.16(SIM_CLK) U17.6(Cathode)
sim_D: C41.2 R18.2 SIM1.15(SIM_DATA) U17.4(Cathode)
sim_RST: C43.2 R19.1 SIM1.17(SIM_RST) U17.1(Cathode)
sim_VCC: C42.2 SIM1.18(SIM_VDD) SIM2.1(SIM_VCC) U17.3(Cathode)
NetC40_2: C40.2 SIM1.28(VRTC)
NetLED1_A: LED1.A R16.2
NetLED2_A: LED2.A R17.2
NetR18_1: R18.1 SIM2.6(SIMDATA)
NetR19_2: R19.2 SIM2.2(SIMRST)
NetR20_2: R20.2 SIM2.3(SIMCLK)

Not connected (* = marked no-connect by the designer): SIM1 3(USART1_RTS) 4(USART1_CTS) 5(USART1_DCD) 6(USART1_DTR) 9(MICP) 10(MICN) 11(SPKP) 12(SPKN) 14(SIM_DET) 22(USART2_TXD) 23(USART2_RXD) 24(USB_VBUS) 25(USB_DP) 26(USB_DM) 29(RF_SYNC) 38(ADC) 40(VDD_EXT); SIM2 5(SIMVPP)

### Notes on the sheet
- GSM SIM800C

### Library data of the parts
ANT1 ANT3 = ANT SMA: Antenna; pin to pad: 1>S 2>G; Designer: Ali Hafizi
ANT2 ANT4 = ANT SMA: Antenna; Designer: Ali Hafizi
C36 = Cap-Polar: Tantal Capacitor Size A; Designer: Saeid Jorablo; Organazation: ControTec; Adding Date: 1387/12/20
C37-C44 = Cap ceramic: Capacitor
D10 = D Zener: Zener Diode; Published: 8-Jun-2000; LatestRevisionDate: 17-Jul-2002; LatestRevisionNote: Re-released for DXP Platform.; PackageReference: DIODE-0.7; Publisher: Altium Limited; PackageDescription: Diode, Thru-Hole; 2 Leads; 0.7 in Pin Spacing
LED1 LED2 = LED: LED SMD; pin to pad: K>C; Published: 8-Jun-2000; LatestRevisionDate: 08-Jul-2005; LatestRevisionNote: Mech Layer 1 removed.; Publisher: Altium Limited
R16-R20 = Res1: Resistor; Published: 8-Jun-2000; LatestRevisionDate: 17-Jul-2002; LatestRevisionNote: Re-released for DXP Platform.; PackageReference: AXIAL-0.3; Publisher: Altium Limited; PackageDescription: Axial Device, Thru-Hole; 2 Leads; 0.3 in Pin Spacing
SIM1 = SIM800C: GSM Module; Designer: Ali Hafizi
SIM2 = SIM HOLDER: Deigner: Ali Hafizi
U17 = MMQA5V6T1: TVS diode ESD protection

## Sheet lcd.SchDoc
size A4
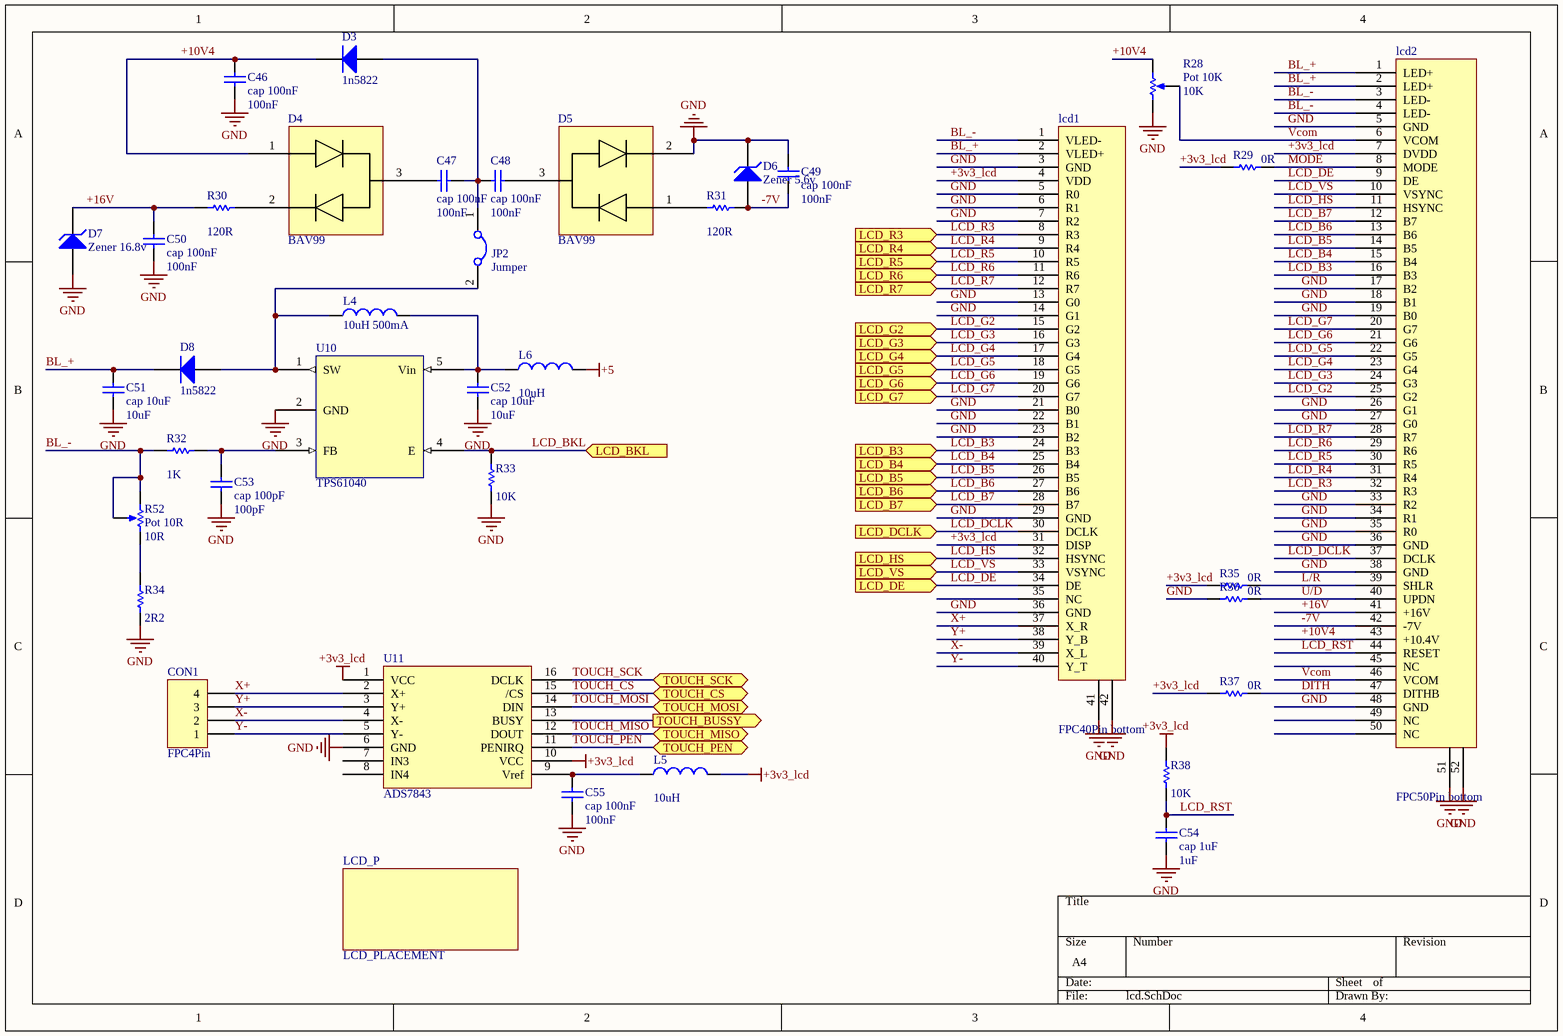
[diagram p4: lcd.SchDoc]

### Parts
C46  cap 100nF  value 100nF  [Cap 805]
C47  cap 100nF  value 100nF  [Cap 805]
C48  cap 100nF  value 100nF  [Cap 805]
C49  cap 100nF  value 100nF  [Cap 805]
C50  cap 100nF  value 100nF  [Cap 805]
C51  cap 10uF  value 10uF  [Cap 805]
C52  cap 10uF  value 10uF  [Cap 805]
C53  cap 100pF  value 100pF  [Cap 805]
C54  cap 1uF  value 1uF  [Cap 805]
C55  cap 100nF  value 100nF  [Cap 805]
CON1  FPC4Pin  [FPC-4pin-1mm]
D3  1n5822  [SMA DIODE 2]
D4  BAV99  [SOT23_BEC_N]
D5  BAV99  [SOT23_BEC_N]
D6  Zener 5.6v  [Diode 1n4148 SMD]
D7  Zener 16.8v  [Diode 1n4148 SMD]
D8  1n5822  [SMA DIODE 2]
JP2  Jumper  [Jumper Small - 2.54 - GRAY]  (no BOM)
L4  value 10uH 500mA  [Inductor SMD 3x3.2mm]  (hidden comment: inductor 10uH 500mA)
L5  value 10uH  [IND1206]  (hidden comment: inductor 10uH)
L6  value 10uH  [IND1206]  (hidden comment: inductor 10uH)
lcd1  FPC40Pin bottom  [FPC40]
lcd2  FPC50Pin bottom  [FPC50pin]
LCD_P  LCD_PLACEMENT  [LCD_7"_placement]  (no BOM)
R28  Pot 10K  value 10K  [Multi Turn 02]
R29  value 0R  [RES 0805 (2012X06L)]  (hidden comment: Res 0R)
R30  value 120R  [RES 0805 (2012X06L)]  (hidden comment: Res 120R)
R31  value 120R  [RES 0805 (2012X06L)]  (hidden comment: Res 120R)
R32  value 1K  [RES 0805 (2012X06L)]  (hidden comment: Res 1K)
R33  value 10K  [RES 0805 (2012X06L)]  (hidden comment: Res 10K)
R34  value 2R2  [RES 0805 (2012X06L)]  (hidden comment: Res 2R2)
R35  value 0R  [RES 0805 (2012X06L)]  (hidden comment: Res 0R)
R36  value 0R  [RES 0805 (2012X06L)]  (hidden comment: Res 0R)
R37  value 0R  [RES 0805 (2012X06L)]  (hidden comment: Res 0R)
R38  value 10K  [RES 0805 (2012X06L)]  (hidden comment: Res 10K)
R52  Pot 10R  value 10R  [Multi Turn 02]
U10  TPS61040  [SOT23-5_N]
U11  ADS7843  [XPT]

### Ports
LCD_B3 (in), LCD_B4 (in), LCD_B5 (in), LCD_B6 (in), LCD_B7 (in), LCD_BKL (in), LCD_DCLK (in), LCD_DE (in), LCD_G2 (in), LCD_G3 (in), LCD_G4 (in), LCD_G5 (in), LCD_G6 (in), LCD_G7 (in), LCD_HS (in), LCD_R3 (in), LCD_R4 (in), LCD_R5 (in), LCD_R6 (in), LCD_R7 (in), LCD_VS (in), TOUCH_BUSSY (out), TOUCH_CS (bidir), TOUCH_MISO (bidir), TOUCH_MOSI (bidir), TOUCH_PEN (bidir), TOUCH_SCK (bidir)

### Nets
+3v3_lcd: L5.2 lcd1.4(VDD) lcd1.31(DISP) lcd2.7(DVDD) R29.2 R35.2 R37.2 R38.2 U11.1(VCC) U11.10(VCC)
+5: L6.2
GND: C46.2 C49.1 C50.2 C51.2 C52.2 C53.2 C54.1 C55.2 D5.2 D6.2(K) D7.1(A) lcd1.3(GND) lcd1.5(R0) lcd1.6(R1) lcd1.7(R2) lcd1.13(G0) lcd1.14(G1) lcd1.21(B0) lcd1.22(B1) lcd1.23(B2) lcd1.29(GND) lcd1.36(GND) lcd1.41 lcd1.42 lcd2.5(GND) lcd2.17(B2) lcd2.18(B1) lcd2.19(B0) lcd2.26(G1) lcd2.27(G0) lcd2.33(R2) lcd2.34(R1) lcd2.35(R0) lcd2.36(GND) lcd2.38(GND) lcd2.48(GND) lcd2.51 lcd2.52 R28.1(TOP) R33.1 R34.1 R36.2 U10.2(GND) U11.6(GND)
+10V4: C46.1 D3.2(K) D4.1 lcd2.43(+10.4V) R28.2(BOT)
+16V: C50.1 D7.2(K) lcd2.41(+16V) R30.2
-7V: C49.2 D6.1(A) lcd2.42(-7V) R31.1
BL_+: C51.1 D8.2(K) lcd1.2(VLED+) lcd2.1(LED+) lcd2.2(LED+)
BL_-: lcd1.1(VLED-) lcd2.3(LED-) lcd2.4(LED-) R32.2 R52.1(TOP) R52.3(TAP)
DITH: lcd2.47(DITHB) R37.1
L/R: lcd2.39(SHLR) R35.1
LCD_B3: lcd1.24(B3) lcd2.16(B3) ; port LCD_B3
LCD_B4: lcd1.25(B4) lcd2.15(B4) ; port LCD_B4
LCD_B5: lcd1.26(B5) lcd2.14(B5) ; port LCD_B5
LCD_B6: lcd1.27(B6) lcd2.13(B6) ; port LCD_B6
LCD_B7: lcd1.28(B7) lcd2.12(B7) ; port LCD_B7
LCD_BKL: R33.2 U10.4(E) ; port LCD_BKL
LCD_DCLK: lcd1.30(DCLK) lcd2.37(DCLK) ; port LCD_DCLK
LCD_DE: lcd1.34(DE) lcd2.9(DE) ; port LCD_DE
LCD_G2: lcd1.15(G2) lcd2.25(G2) ; port LCD_G2
LCD_G3: lcd1.16(G3) lcd2.24(G3) ; port LCD_G3
LCD_G4: lcd1.17(G4) lcd2.23(G4) ; port LCD_G4
LCD_G5: lcd1.18(G5) lcd2.22(G5) ; port LCD_G5
LCD_G6: lcd1.19(G6) lcd2.21(G6) ; port LCD_G6
LCD_G7: lcd1.20(G7) lcd2.20(G7) ; port LCD_G7
LCD_HS: lcd1.32(HSYNC) lcd2.11(HSYNC) ; port LCD_HS
LCD_R3: lcd1.8(R3) lcd2.32(R3) ; port LCD_R3
LCD_R4: lcd1.9(R4) lcd2.31(R4) ; port LCD_R4
LCD_R5: lcd1.10(R5) lcd2.30(R5) ; port LCD_R5
LCD_R6: lcd1.11(R6) lcd2.29(R6) ; port LCD_R6
LCD_R7: lcd1.12(R7) lcd2.28(R7) ; port LCD_R7
LCD_RST: C54.2 lcd2.44(RESET) R38.1
LCD_VS: lcd1.33(VSYNC) lcd2.10(VSYNC) ; port LCD_VS
MODE: lcd2.8(MODE) R29.1
TOUCH_CS: U11.15(/CS) ; port TOUCH_CS
TOUCH_MISO: U11.12(DOUT) ; port TOUCH_MISO
TOUCH_MOSI: U11.14(DIN) ; port TOUCH_MOSI
TOUCH_PEN: U11.11(PENIRQ) ; port TOUCH_PEN
TOUCH_SCK: U11.16(DCLK) ; port TOUCH_SCK
U/D: lcd2.40(UPDN) R36.1
Vcom: lcd2.6(VCOM) lcd2.46(VCOM) R28.3(TAP)
X+: CON1.4 lcd1.37(X_R) U11.2(X+)
X-: CON1.2 lcd1.39(X_L) U11.4(X-)
Y+: CON1.3 lcd1.38(Y_B) U11.3(Y+)
Y-: CON1.1 lcd1.40(Y_T) U11.5(Y-)
NetC47_1: C47.1 C48.2 D3.1(A) JP2.1
NetC47_2: C47.2 D4.3
NetC48_1: C48.1 D5.3
NetC52_1: C52.1 L4.2 L6.1 U10.5(Vin)
NetC53_1: C53.1 R32.1 U10.3(FB)
NetC55_1: C55.1 L5.1 U11.9(Vref)
NetD4_2: D4.2 R30.1
NetD5_1: D5.1 R31.2
NetD8_1: D8.1(A) JP2.2 L4.1 U10.1(SW)
NetR34_2: R34.2 R52.2(BOT)
NetU11_13: U11.13(BUSY) ; port TOUCH_BUSSY

Not connected (* = marked no-connect by the designer): lcd1 35(NC); lcd2 45(NC) 49(NC) 50(NC); U11 7(IN3) 8(IN4)

### Library data of the parts
C46-C55 = Cap: Capacitor; Published: 8-Jun-2000; LatestRevisionDate: 17-Jul-2002; LatestRevisionNote: Re-released for DXP Platform.; PackageReference: RAD-0.3; Publisher: Altium Limited; PackageDescription: Radial Cap, Thru-Hole; 2 Leads; 0.3 in Pin Spacing
CON1 = Header 4: touchpad FPC; LatestRevisionDate: 17-Jul-2002; LatestRevisionNote: Re-released for DXP Platform.; Publisher: Altium Limited
D3 D8 = Diode 1N4007: 1 Amp schottky Diode; Published: 8-Jun-2000; LatestRevisionDate: 17-Jul-2002; LatestRevisionNote: Re-released for DXP Platform.; DatasheetVersion: 1998; PackageVersion: Aug-1999; PackageReference: DO-41; Publisher: Altium Limited; PackageDescription: Diode, Axial; Body 5.2 x 2.7 mm (LxDia. max), Lead Dia. 0.86 mm (max); Code_JEDEC: DO-204-AL; ComponentLink1Description: Manufacturer Link; ComponentLink1URL: http://www.fairchildsemi.com/; ComponentLink2Description: Datasheet; ComponentLink2URL: http://www.fairchildsemi.com/ds/1N%2F1N4001.pdf
D4 D5 = BAV99: Schottky Diode package
D6 D7 = D Zener: Zener Diode; Published: 8-Jun-2000; LatestRevisionDate: 17-Jul-2002; LatestRevisionNote: Re-released for DXP Platform.; PackageReference: DIODE-0.7; Publisher: Altium Limited; PackageDescription: Diode, Thru-Hole; 2 Leads; 0.7 in Pin Spacing
JP2 = Jumper: 50pin lcd select; Company: E.P.I.L; Defualt State: Close; Design Date: 2011/11/02
L4 = Inductor: Inductor 3*3.2mm; Code_IEC: 1005; Published: 8-Jun-2000; LatestRevisionDate: 29-May-2009; LatestRevisionNote: IPC-7351 Footprint Added.; PackageReference: 0402-A; Publisher: Altium Limited; PackageDescription: Chip Inductor; Code_JEITA: 0402
L5 L6 = Inductor: Code_IEC: 1005; Published: 8-Jun-2000; LatestRevisionDate: 29-May-2009; LatestRevisionNote: IPC-7351 Footprint Added.; PackageReference: 0402-A; Publisher: Altium Limited; PackageDescription: Chip Inductor; Code_JEITA: 0402
lcd1 = LCD_40pin: 4.3" RGB LCD
lcd2 = LCD_50pin: 7" LCD
R28 R52 = RPot: Potentiometer; Sim Note: Enter the Resistance value and the set point into parameter fields.; Set Position: 0.5; Published: 8-Jun-2000; LatestRevisionDate: 17-Jul-2002; LatestRevisionNote: Re-released for DXP Platform.; PackageReference: VR5; Publisher: Altium Limited; PackageDescription: Variable Resistor, Thru-Hole; 3 Leads
R29-R38 = Res1: Resistor; Published: 8-Jun-2000; LatestRevisionDate: 17-Jul-2002; LatestRevisionNote: Re-released for DXP Platform.; PackageReference: AXIAL-0.3; Publisher: Altium Limited; PackageDescription: Axial Device, Thru-Hole; 2 Leads; 0.3 in Pin Spacing
U10 = TPS61040: pwm led controller
U11 = ADS7843: SPI touch

## Sheet power.SchDoc
size A4
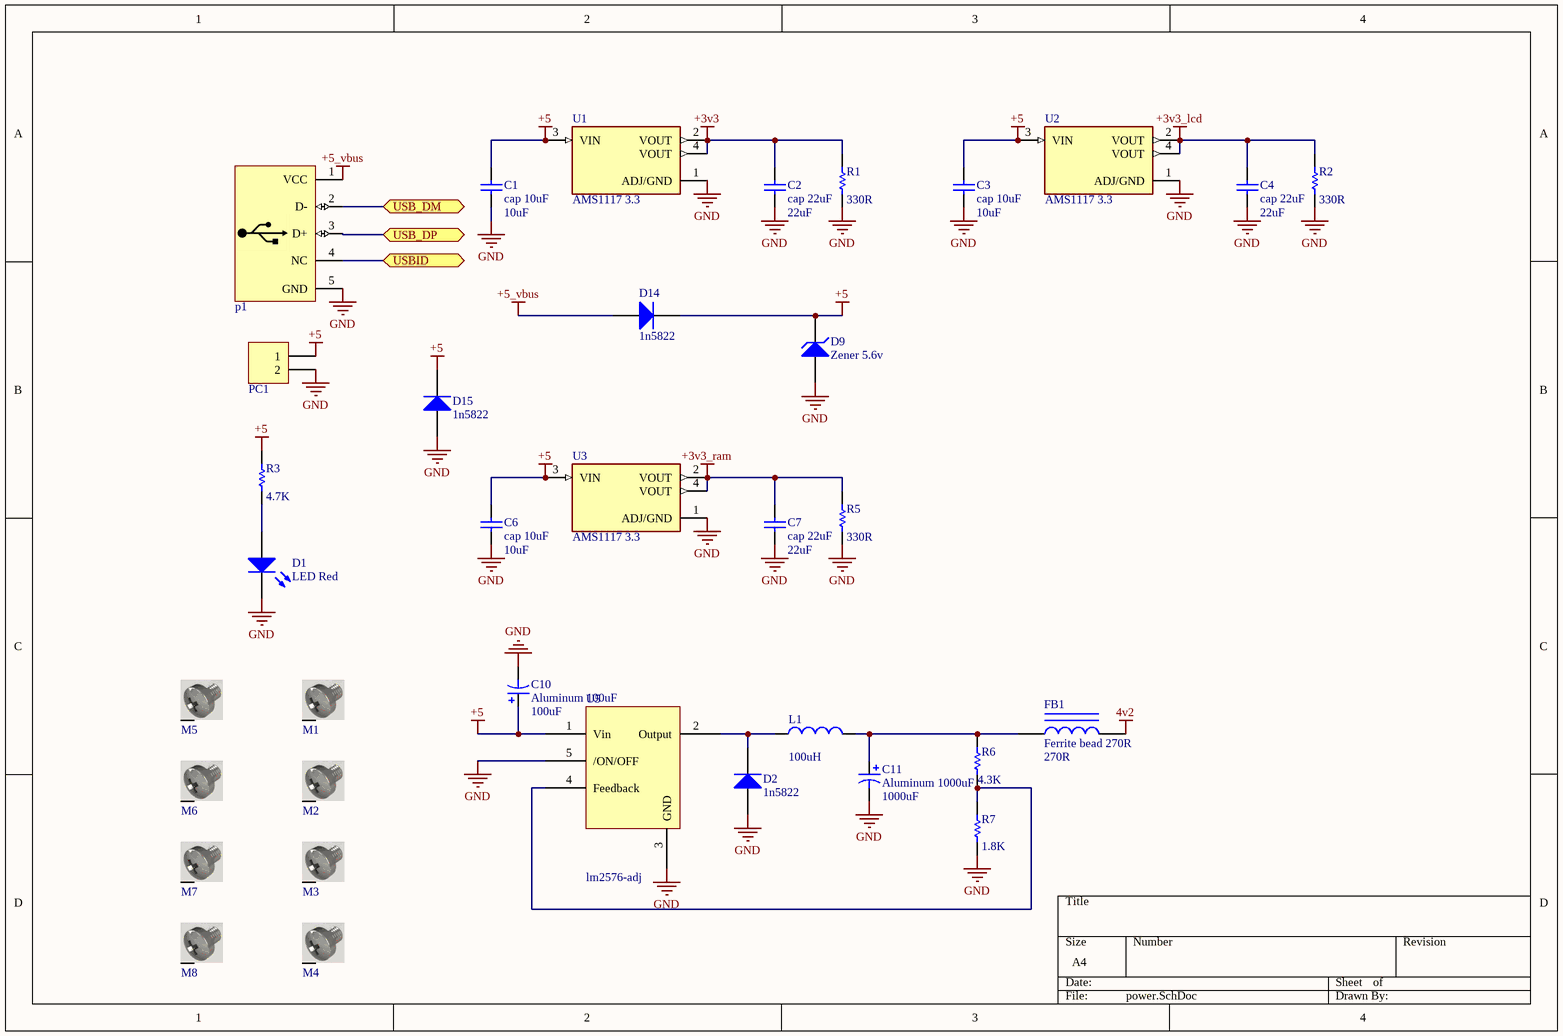
[diagram p5: power.SchDoc]

### Parts
C1  cap 10uF  value 10uF  [Cap 805]
C2  cap 22uF  value 22uF  [Cap 805]
C3  cap 10uF  value 10uF  [Cap 805]
C4  cap 22uF  value 22uF  [Cap 805]
C6  cap 10uF  value 10uF  [Cap 805]
C7  cap 22uF  value 22uF  [Cap 805]
C10  Aluminum 100uF  value 100uF  [Cap SMD 100UF 35~50v]
C11  Aluminum 1000uF  value 1000uF  [CAP SMD 1000UF 16V]
D1  LED Red  [0805-LED]
D2  1n5822  [SMA DIODE 2]
D9  Zener 5.6v  [Diode 1n4148 SMD]
D14  1n5822  [SMA DIODE 2]
D15  1n5822  [SMA DIODE 2]
FB1  Ferrite bead 270R  value 270R  [FB1206]
L1  value 100uH  [inductor]  (hidden comment: inductor 100uH)
M1  Spacer-ff 10mm  [Screw]  (value not drawn)
M2  Spacer-ff 10mm  [screw]  (value not drawn)
M3  Spacer-ff 10mm  [screw]  (value not drawn)
M4  Spacer-ff 10mm  [screw]  (value not drawn)
M5  Spacer-ff 10mm  [Screw]  (value not drawn)
M6  Spacer-ff 10mm  [screw]  (value not drawn)
M7  Spacer-ff 10mm  [screw]  (value not drawn)
M8  Spacer-ff 10mm  [screw]  (value not drawn)
p1  USB Connector  [USB_AB_BM_SHS]  (value not drawn)
PC1  Power Connector  [My_ Power_Connector]  (value not drawn)
R1  value 330R  [RES 0805 (2012X06L)]  (hidden comment: Res 330R)
R2  value 330R  [RES 0805 (2012X06L)]  (hidden comment: Res 330R)
R3  value 4.7K  [RES 0805 (2012X06L)]  (hidden comment: Res 4.7K)
R5  value 330R  [RES 0805 (2012X06L)]  (hidden comment: Res 330R)
R6  value 4.3K  [RES 0805 (2012X06L)]  (hidden comment: Res 4.3K)
R7  value 1.8K  [RES 0805 (2012X06L)]  (hidden comment: Res 1.8K)
U1  AMS1117 3.3  [SOT229P700X180-4N]
U2  AMS1117 3.3  [SOT229P700X180-4N]
U3  AMS1117 3.3  [SOT229P700X180-4N]
U5  lm2576-adj  [2596]

### Ports
USB_DM (bidir), USB_DP (bidir), USBID (bidir)

### Nets
4v2: FB1.2
+3v3: C2.2 R1.2 U1.2(VOUT) U1.4(VOUT)
+3v3_lcd: C4.2 R2.2 U2.2(VOUT) U2.4(VOUT)
+3v3_ram: C7.2 R5.2 U3.2(VOUT) U3.4(VOUT)
+5: C1.2 C3.2 C6.2 C10.1 D9.2(K) D14.2(K) D15.2(K) PC1.1 R3.2 U1.3(VIN) U2.3(VIN) U3.3(VIN) U5.1(Vin)
+5_vbus: D14.1(A) p1.1(VCC)
GND: C1.1 C2.1 C3.1 C4.1 C6.1 C7.1 C10.2 C11.2 D1.2(K) D2.1(A) D9.1(A) D15.1(A) p1.5(GND) PC1.2 R1.1 R2.1 R5.1 R7.1 U1.1(ADJ/GND) U2.1(ADJ/GND) U3.1(ADJ/GND) U5.3(GND) U5.5(/ON/OFF)
USB_DM: p1.2(D-) ; port USB_DM
USB_DP: p1.3(D+) ; port USB_DP
USBID: p1.4(NC) ; port USBID
NetC11_1: C11.1 FB1.1 L1.2 R6.2
NetD1_1: D1.1(A) R3.1
NetD2_2: D2.2(K) L1.1 U5.2(Output)
NetR6_1: R6.1 R7.2 U5.4(Feedback)

Not connected (* = marked no-connect by the designer): M1 S; M2 S; M3 S; M4 S; M5 S; M6 S; M7 S; M8 S

### Library data of the parts
C1-C4 C6 C7 = Cap: Capacitor; Published: 8-Jun-2000; LatestRevisionDate: 17-Jul-2002; LatestRevisionNote: Re-released for DXP Platform.; PackageReference: RAD-0.3; Publisher: Altium Limited; PackageDescription: Radial Cap, Thru-Hole; 2 Leads; 0.3 in Pin Spacing
C10 C11 = Cap Pol1: Polarized Capacitor Aluminum; Published: 8-Jun-2000; LatestRevisionDate: 17-Jul-2002; LatestRevisionNote: Re-released for DXP Platform.; PackageReference: RB7.6-15; Publisher: Altium Limited; PackageDescription: Polarized Capacitor (Radial); 2 Leads
D1 = LED0: LED SMD; pin to pad: 1>A 2>C; Published: 8-Jun-2000; LatestRevisionDate: 08-Jul-2005; LatestRevisionNote: Mech Layer 1 removed.; PackageReference: LED-0; Publisher: Altium Limited; PackageDescription: LED; 2 Leads
D2 D14 D15 = Diode 1N4007: 1 Amp schottky Diode; Published: 8-Jun-2000; LatestRevisionDate: 17-Jul-2002; LatestRevisionNote: Re-released for DXP Platform.; DatasheetVersion: 1998; PackageVersion: Aug-1999; PackageReference: DO-41; Publisher: Altium Limited; PackageDescription: Diode, Axial; Body 5.2 x 2.7 mm (LxDia. max), Lead Dia. 0.86 mm (max); Code_JEDEC: DO-204-AL; ComponentLink1Description: Manufacturer Link; ComponentLink1URL: http://www.fairchildsemi.com/; ComponentLink2Description: Datasheet; ComponentLink2URL: http://www.fairchildsemi.com/ds/1N%2F1N4001.pdf
D9 = D Zener: Zener Diode; Published: 8-Jun-2000; LatestRevisionDate: 17-Jul-2002; LatestRevisionNote: Re-released for DXP Platform.; PackageReference: DIODE-0.7; Publisher: Altium Limited; PackageDescription: Diode, Thru-Hole; 2 Leads; 0.7 in Pin Spacing
FB1 = Inductor Iron: Ferrite bead smd 1206; Published: 24-Mar-1999; LatestRevisionDate: 17-Jul-2002; LatestRevisionNote: Re-released for DXP Platform.; PackageReference: AXIAL-0.9; Publisher: Altium Limited; PackageDescription: Axial Device, Thru-Hole; 2 Leads; 0.9 in Pin Spacing
L1 = Inductor: Inductor 12*12mm; Code_IEC: 1005; Published: 8-Jun-2000; LatestRevisionDate: 29-May-2009; LatestRevisionNote: IPC-7351 Footprint Added.; PackageReference: 0402-A; Publisher: Altium Limited; PackageDescription: Chip Inductor; Code_JEITA: 0402
M1-M8 = Board Screw: Board Screw With Spacer
p1 = USB MICRO: USB Connector MICRO-B Type; Designer: ABBAS BASEREH; Max Current: 1600mA; Mounting Technology: Surface Mount\Through-Hole; Category: Connector; Pin Count: 5-7; Publisher: ABBAS BASEREH; Status: Unreleased; ComponentLink1Description: Datasheet; ComponentLink2Description: Reference; Update: 1395-11-17
PC1 = Power Connector: white Power Connector
R1-R3 R5-R7 = Res1: Resistor; Published: 8-Jun-2000; LatestRevisionDate: 17-Jul-2002; LatestRevisionNote: Re-released for DXP Platform.; PackageReference: AXIAL-0.3; Publisher: Altium Limited; PackageDescription: Axial Device, Thru-Hole; 2 Leads; 0.3 in Pin Spacing
U1-U3 = AMS1117: MF: Seeed Technology; Availability: Unavailable; SnapEDA_Link: https://www.snapeda.com/parts/AMS1117/Seeed%20Technology%20Co.%2C%20Ltd/view-part/184428/?ref=snap; MP: AMS1117; Price: None; Value: *; Package: SOT-223 Seeed Technology
U5 = lm2596